# EAGLE design ADCTest1 (EAGLE 7.3.0)
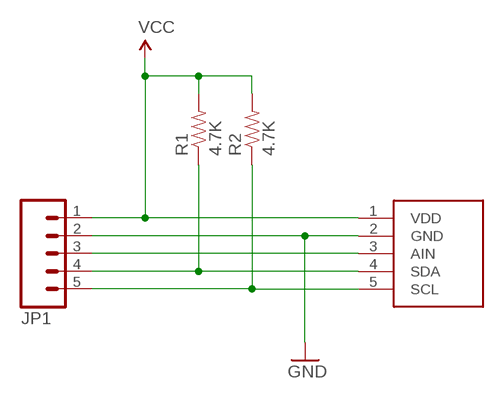
[diagram p0: schematic, sheet 1]

## Parts
JP1  M05PTH  [1X05]
R1  4.7K  RES-4.7K-0603  [0603-RES]
R2  4.7K  RES-4.7K-0603  [0603-RES]
U$1  MCP3021-ADC  [SOT-23-5-MICROCHIP]

## Nets
GND: JP1.2 U$1.2(GND)
N$3: JP1.3 U$1.3(AIN)
N$4: JP1.4 R1.1 U$1.4(SDA)
N$5: JP1.5 R2.1 U$1.5(SCL)
VCC: JP1.1 R1.2 R2.2 U$1.1(VDD)

## Library data of the parts
JP1 = rickk2:M05: Header 5 Standard 5-pin 0.1" header. Use with straight break away headers (SKU : PRT-00116), right angle break away headers (PRT-00553), swiss pins (PRT-00743), machine pins (PRT-00117), and female headers (PRT-00115). Molex polarized connector foot print use with SKU : PRT-08230 with associated crimp pins and housings.
R1 R2 = rickk2:RES-4.7K-0603: RES SMD 4.7K OHM 5% 1/4W 0603 $ 0.11 https://www.digikey.com/product-detail/en/panasonic-electronic-components/ERJ-PA3J472V/P4.7KBZCT-ND/5036332 Panasonic
U$1 = rickk2:MCP3021-ADC: IC ADC 10BIT 2.7V 1CH SOT23-5 $ 1.12 Microchip MCP3021A5T-E/OT 10-bit ADC SOT-23-5 1 channel 2.7 to 5.5V supply https://www.digikey.com/product-detail/en/microchip-technology/MCP3021A5T-E-OT/MCP3021A5T-E-OTCT-ND/1979808

## Board
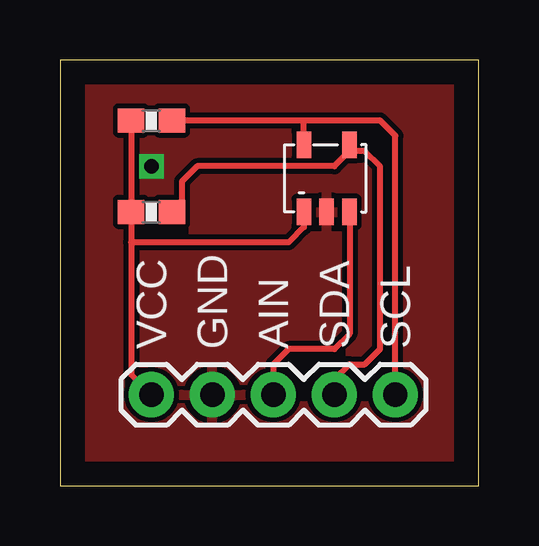
[diagram p1: board, top side]
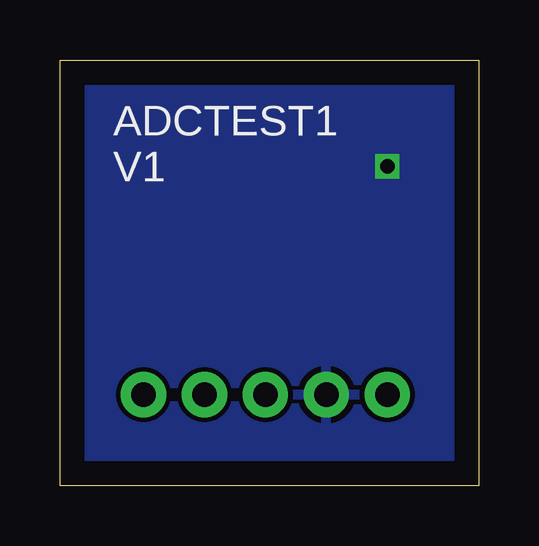
[diagram p2: board, bottom side, seen from below]

Size 17.45 x 17.77 mm. Coordinates in mm from the lower left corner, seen from the top.
Outline: 0,0 17.45,0 17.45,17.77 0,17.77 0,0
Copper layers (1*16): Top 0.035mm / dielectric 1.5mm / Bottom 0.035mm
Design rules "default": minimum track width 10mil, minimum drill 24mil, track to track 8mil, track to pad 8mil, pad to pad 8mil, via to via 8mil, smd to smd 8mil, copper to edge 40mil, drill to drill 8mil, minimum pad ring 10mil, minimum via ring 8mil, stop-mask expansion 4mil, vias tented up to drill 0mil, thermal gap 10mil

### Footprints (pad centres in the part's own frame; a part is rotated, then mirrored left to right if it is on the bottom)
1X05 = drill 1.016 pad 1.88: 1 0,0; 2 2.54,0; 3 5.08,0; 4 7.62,0; 5 10.16,0
0603-RES = smd 1.1 x 1: 1 -0.85,0; 2 0.85,0
SOT-23-5-MICROCHIP = smd 0.6 x 1.1: 1 0,0; 2 0.95,0; 3 1.9,0; 4 1.9,2.8; 5 0,2.8

### Placement (x,y rotation side)
JP1  3.81,3.81 0 top
R1  3.81,11.43 180 top
R2  3.81,15.24 180 top
U$1  10.16,11.43 0 top

### Tracks (layer width: path | path; a pad name or v marks a point on that pad's centre or on a via)
GND  (via drill 0.6)
  other vias: 3.81,13.34
  pour Bottom: 0,0 0,17.78 17.78,17.78 17.78,0
  pour Top: 0,0 0,17.78 17.78,17.78 17.78,0
N$3
  Top 0.254: U$1.3 12.06,6.35 11.43,5.71 9.53,5.71 8.89,5.08 JP1.3
N$4
  Top 0.254: JP1.4 11.43,4.45 12.06,5.08 12.7,5.08 13.34,5.71 13.34,13.34 12.7,13.97 12.32,13.97 U$1.4 12.06,13.96 11.43,13.34 5.71,13.34 5.08,12.7 5.08,11.85 R1.1
N$5
  Top 0.254: JP1.5 13.97,14.61 13.34,15.24 10.16,15.24 | 10.16,15.24 R2.1 | U$1.5 10.16,15.24
VCC
  Top 0.254: R2.2 R1.2 2.96,10.16 | 2.96,10.16 2.96,4.66 JP1.1 | U$1.1 10.16,10.79 9.53,10.16 2.96,10.16

### Text on the board
tPlace: VCC | GND | AIN | SDA | SCL
bPlace: ADCTEST1 / V1
Document: MCP3021